# EAGLE design RevellerZero (EAGLE 7.6.0)
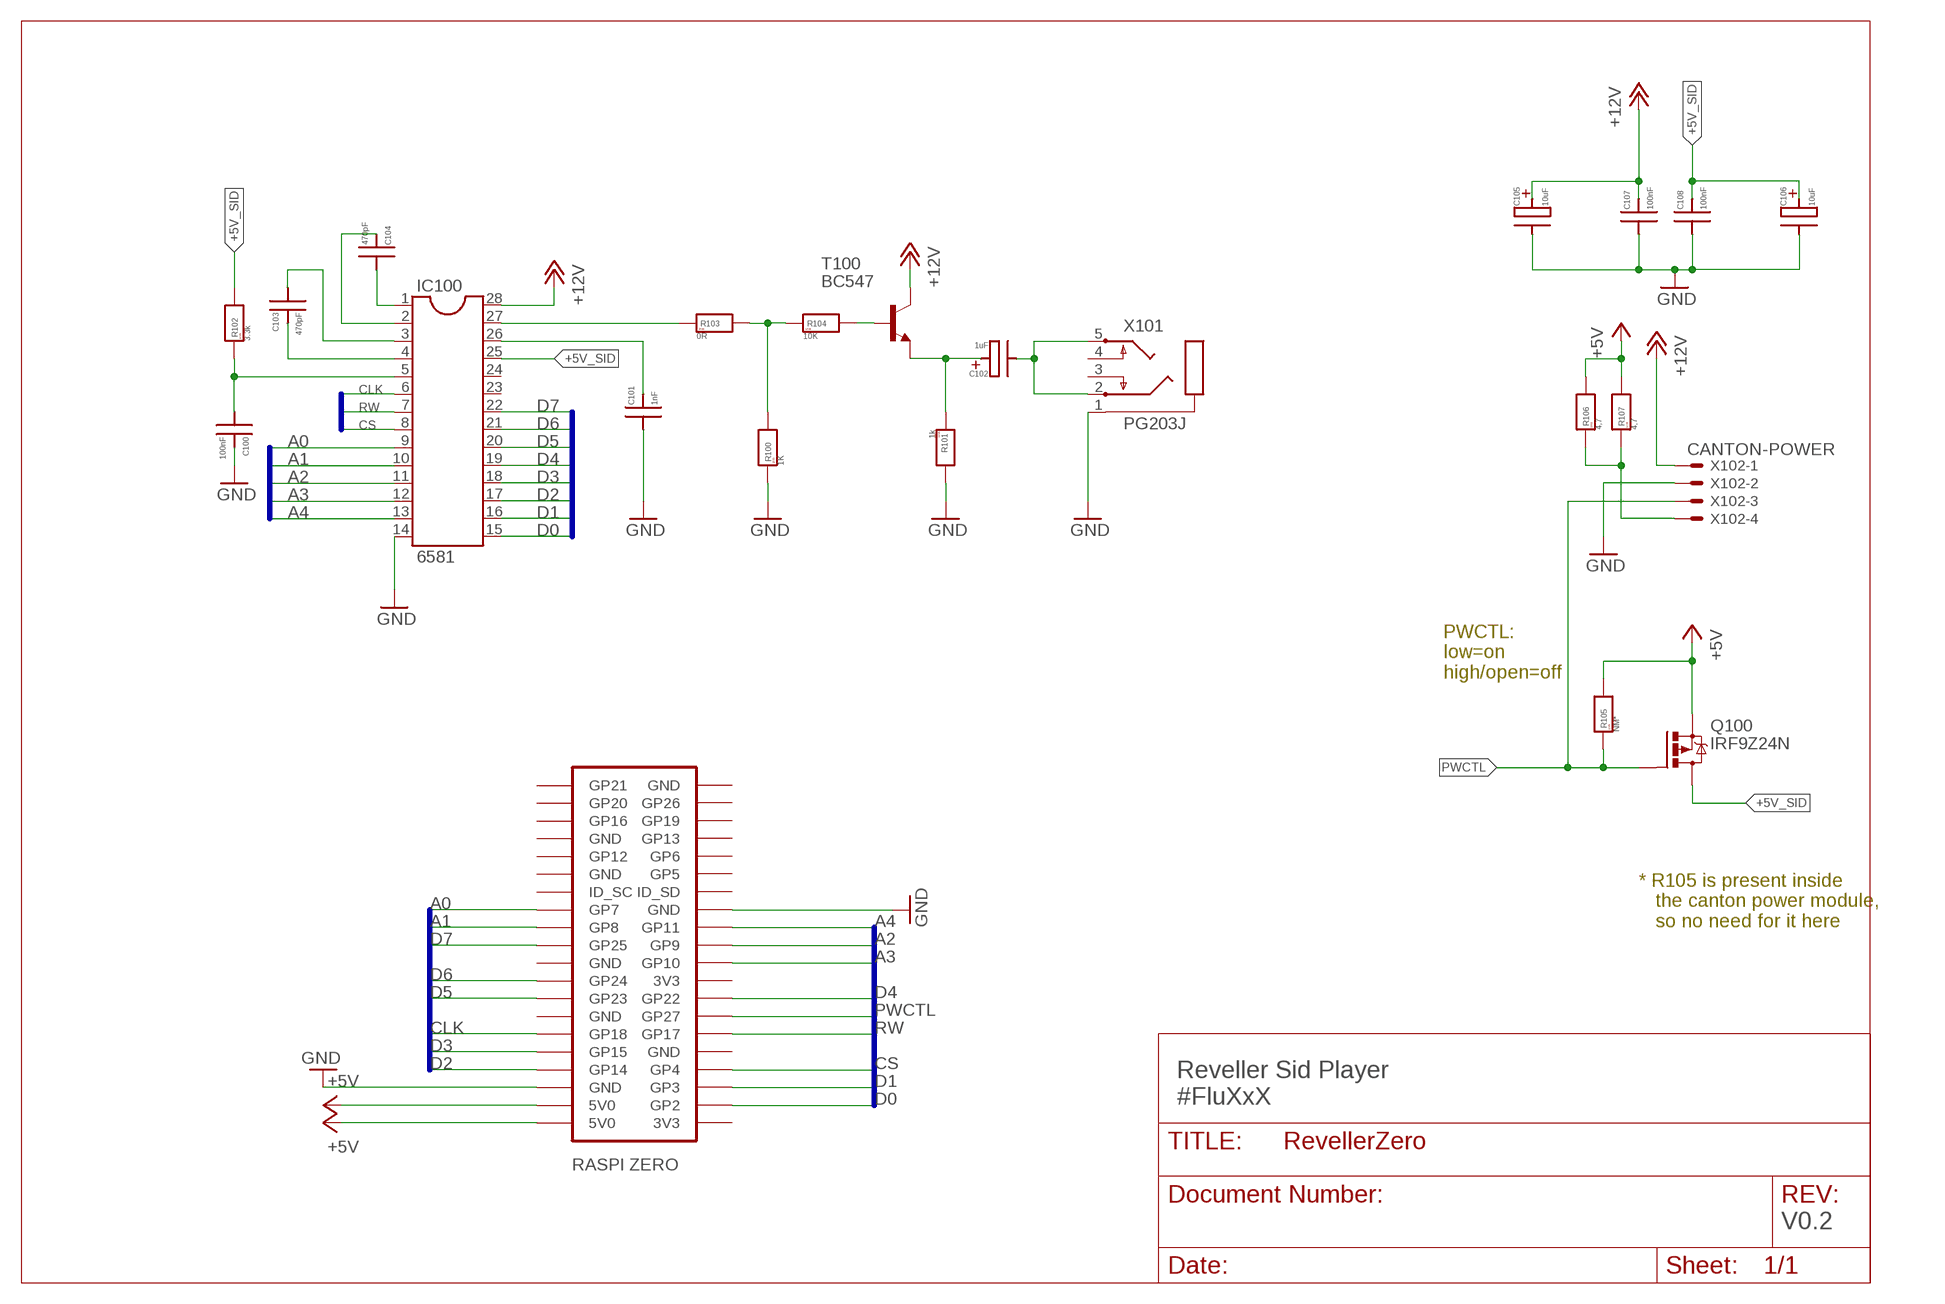
[diagram p0: schematic, sheet 1]

## Parts
C100  100nF  SMD-IPC_CAPC1206  [SMD-IPC_C1206]
C101  1nF  SMD-IPC_CAPC1206  [SMD-IPC_C1206]
C102  1uF  SMD-IPC_CAPPOLPXE_H  [PXE-H]
C103  470pF  SMD-IPC_CAPC1206  [SMD-IPC_C1206]
C104  470pF  SMD-IPC_CAPC1206  [SMD-IPC_C1206]
C105  10uF  SMD-IPC_CAPPOLC7343  [SMD-IPC_CT7343]
C106  10uF  SMD-IPC_CAPPOLC7343  [SMD-IPC_CT7343]
C107  100nF  SMD-IPC_CAPC1206  [SMD-IPC_C1206]
C108  100nF  SMD-IPC_CAPC1206  [SMD-IPC_C1206]
IC100  6581  DIL28  [DIL28-6]
Q100  IRF9Z24N  IRF9530  [TO220BV]
R100  1K  SMD-IPC_RESR1206  [SMD-IPC_R1206]
R101  1k  SMD-IPC_RESR1206  [SMD-IPC_R1206]
R102  3.3k  SMD-IPC_RESR1206  [SMD-IPC_R1206]
R103  0R  SMD-IPC_RESR1206  [SMD-IPC_R1206]
R104  10K  SMD-IPC_RESR1206  [SMD-IPC_R1206]
R105  NM*  SMD-IPC_RESR1206  [SMD-IPC_R1206]
R106  4,7  SMD-IPC_RESR1206  [SMD-IPC_R1206]
R107  4,7  SMD-IPC_RESR1206  [SMD-IPC_R1206]
T100  BC547  [TO92]
U$1  ZERO  [ZERO]
X101  PG203J  [PG203J]
X102  CANTON-POWER  22-23-2041  [22-23-2041]

## Nets
+5V: Q100.S R105.2 R106.2 R107.2 U$1.2(5V0) U$1.4(5V0)
+5V_SID: C106.+ C108.+ IC100.25 Q100.D R102.2
+5VEZ: R106.1 R107.1 X102.4
+12V: C105.+ C107.+ IC100.28 T100.3(C) X102.1
A0 [data]: IC100.9 U$1.26(GP7)
A1 [data]: IC100.10 U$1.24(GP8)
A2 [data]: IC100.11 U$1.21(GP9)
A3 [data]: IC100.12 U$1.19(GP10)
A4 [data]: IC100.13 U$1.23(GP11)
AUDIO_DC: C102.+ R101.1 T100.1(E)
AUDIO_OUT: C102.- X101.2 X101.5
AUDIO_PREAMP: R100.2 R103.2 R104.1
AUDIO_PREAMP_B: R104.2 T100.2(B)
AUDIO_RAW: IC100.27 R103.1
CAP1A: C104.- IC100.1
CAP1B: C104.+ IC100.2
CAP2A: C103.- IC100.3
CAP2B: C103.+ IC100.4
CAPX: C101.+ IC100.26
CLK [data]: IC100.6 U$1.12(GP18)
CS [data]: IC100.8 U$1.7(GP4)
D0 [data]: IC100.15 U$1.3(GP2)
D1 [data]: IC100.16 U$1.5(GP3)
D2 [data]: IC100.17 U$1.8(GP14)
D3 [data]: IC100.18 U$1.10(GP15)
D4 [data]: IC100.19 U$1.15(GP22)
D5 [data]: IC100.20 U$1.16(GP23)
D6 [data]: IC100.21 U$1.18(GP24)
D7 [data]: IC100.22 U$1.22(GP25)
GND: C100.+ C101.- C105.- C106.- C107.- C108.- IC100.14 R100.1 R101.2 U$1.6(GND) U$1.25(GND) X101.1 X102.2
PWCTL [data]: Q100.G R105.1 U$1.13(GP27) X102.3
RESET: C100.- IC100.5 R102.1
RW [data]: IC100.7 U$1.11(GP17)
Unconnected: IC100.23 IC100.24 U$1.1(3V3) U$1.9(GND) U$1.14(GND) U$1.17(3V3) U$1.20(GND) U$1.27(ID_SD) U$1.28(ID_SC) U$1.29(GP5) U$1.30(GND) U$1.31(GP6) U$1.32(GP12) U$1.33(GP13) U$1.34(GND) U$1.35(GP19) U$1.36(GP16) U$1.37(GP26) U$1.38(GP20) U$1.39(GND) U$1.40(GP21) X101.3 X101.4

## Buses
A[0..4]
A0,A1,D7,D6,D5,CLK,D3,D2
CLK,RW,CS
A4,A2,A3,D4,PWCTL,RW,CS,D1,D0
D[0..7]

## Notes on the sheet
- PWCTL:
  low=on
  high/open=off
- * R105 is present inside
     the canton power module,
     so no need for it here
- Reveller Sid Player
  #FluXxX
- V0.2

## Library data of the parts
C100 C101 C103 C104 C107 C108 = cyviz:SMD-IPC_CAP: Capacitor, non polarized
C102 C105 C106 = cyviz:SMD-IPC_CAPPOL: Polarized capacitor
IC100 = ic-package:DIL28: Dual In Line
Q100 = transistor-power:IRF9530: P-CHANNEL HEXFET POWER-MOS-FET Source: http://www.irf.com/product-info/datasheets/data/irf9530.pdf
R100-R107 = cyviz:SMD-IPC_RES: Resistor; SIZE: 1206
T100 = transistor:BC547: NPN TRANSISTOR
U$1 = RasPi:ZERO: Raspbery Pi Foundation Zero https://www.raspberrypi.org/products/pi-zero/
X101 = con-hirschmann:PG203J: MIC/HEADPHONE JACK KS-S stereo microphone/headphone jack PG203JN (Schukat); OC_FARNELL: unknown; OC_NEWARK: unknown
X102 = con-molex:22-23-2041: .100" (2.54mm) Center Header - 4 Pin; MF: MOLEX; MPN: 22-23-2041; OC_FARNELL: 1462920; OC_NEWARK: 38C0355

## Net classes
0 default: clearance 0.205 mm
1 data: width 0.3 mm, drill 0.5 mm

## Board
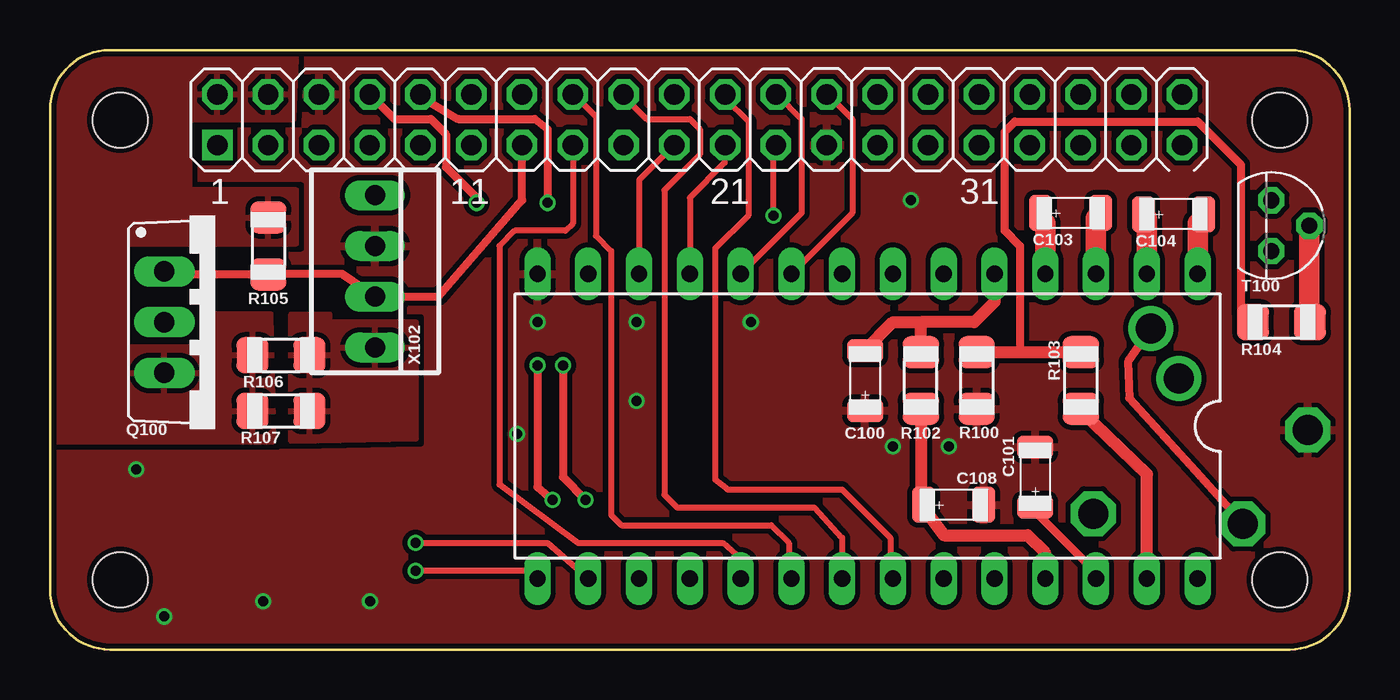
[diagram p1: board, top side]
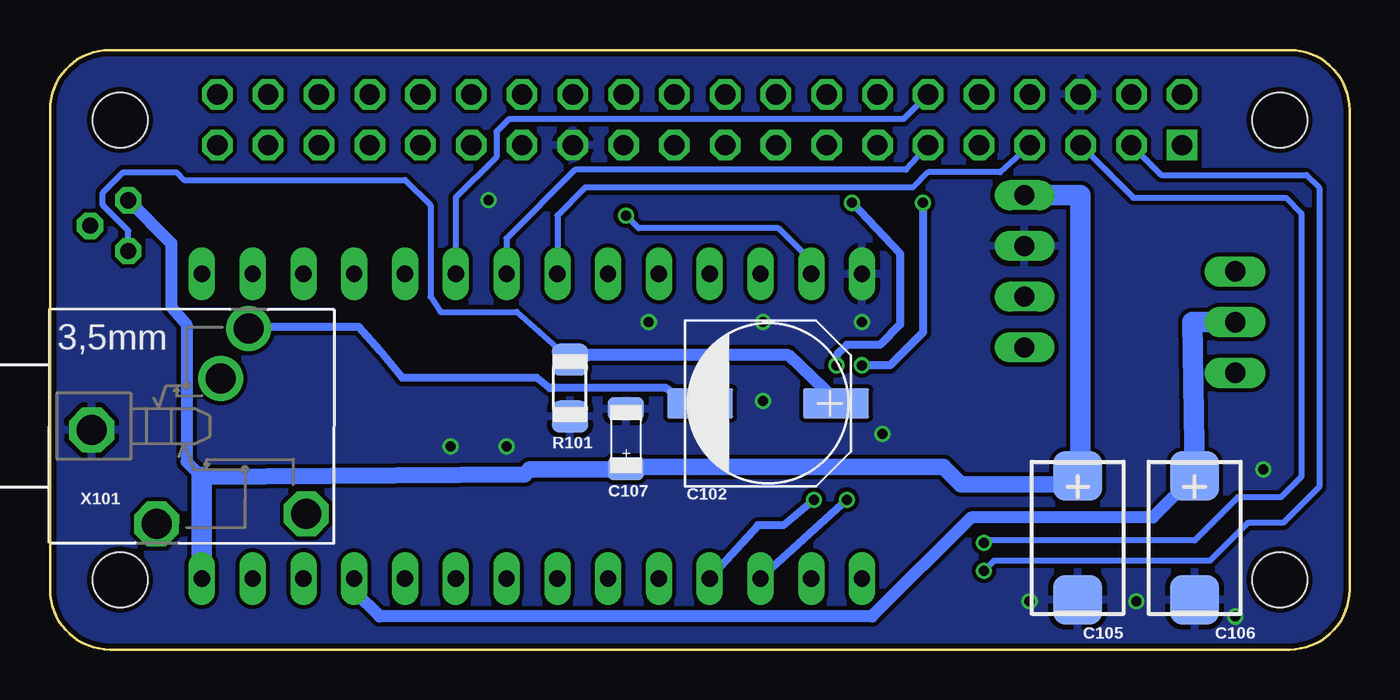
[diagram p2: board, bottom side, seen from below]

Size 65 x 30 mm. Coordinates in mm from the lower left corner, seen from the top.
Copper layers (1*16): Top 0.035mm / dielectric 1.5mm / Bottom 0.035mm
Design rules "SeeedStudio_2layer_DRU_no_angle_20140221": minimum track width 6mil, minimum drill 12mil, track to track 6mil, track to pad 6mil, pad to pad 6mil, via to via 6mil, smd to smd 0mil, copper to edge 10mil, drill to drill 10mil, minimum pad ring 10mil, minimum via ring 6mil, stop-mask expansion 2mil, vias tented up to drill 100mil, thermal gap 10mil

### Footprints (pad centres in the part's own frame; a part is rotated, then mirrored left to right if it is on the bottom)
SMD-IPC_C1206 = smd 1.15 x 1.8: + 1.5,0; - -1.5,0
PXE-H = smd 3.3 x 1.5: + 3.4,0; - -3.4,0
SMD-IPC_CT7343 = smd 2.45 x 2.45: + -3.1,0; - 3.1,0
DIL28-6 = drill 0.813 long: 1 -16.51,-7.62; 2 -13.97,-7.62; 3 -11.43,-7.62; 4 -8.89,-7.62; 5 -6.35,-7.62; 6 -3.81,-7.62; 7 -1.27,-7.62; 8 1.27,-7.62; 9 3.81,-7.62; 10 6.35,-7.62; 11 8.89,-7.62; 12 11.43,-7.62; 13 13.97,-7.62; 14 16.51,-7.62; 15 16.51,7.62; 16 13.97,7.62; 17 11.43,7.62; 18 8.89,7.62; 19 6.35,7.62; 20 3.81,7.62; 21 1.27,7.62; 22 -1.27,7.62; 23 -3.81,7.62; 24 -6.35,7.62; 25 -8.89,7.62; 26 -11.43,7.62; 27 -13.97,7.62; 28 -16.51,7.62
TO220BV = drill 1.016 long: D 0,-2.54; G -2.54,-2.54; S 2.54,-2.54
SMD-IPC_R1206 = smd 1.6 x 1.803: 1 -1.422,0; 2 1.422,0
TO92 = drill 0.813 octagon: 1 1.27,0; 2 0,1.905; 3 -1.27,0
ZERO = drill 1.016 square: 1 8.37,25.24 | drill 1.016 octagon: 2 8.37,27.78; 3 10.91,25.24; 4 10.91,27.78; 5 13.45,25.24; 6 13.45,27.78; 7 15.99,25.24; 8 15.99,27.78; 9 18.53,25.24; 10 18.53,27.78; 11 21.07,25.24; 12 21.07,27.78; 13 23.61,25.24; 14 23.61,27.78; 15 26.15,25.24; 16 26.15,27.78; 17 28.69,25.24; 18 28.69,27.78; 19 31.23,25.24; 20 31.23,27.78; 21 33.77,25.24; 22 33.77,27.78; 23 36.31,25.24; 24 36.31,27.78; 25 38.85,25.24; 26 38.85,27.78; 27 41.39,25.24; 28 41.39,27.78; 29 43.93,25.24; 30 43.93,27.78; 31 46.47,25.24; 32 46.47,27.78; 33 49.01,25.24; 34 49.01,27.78; 35 51.55,25.24; 36 51.55,27.78; 37 54.09,25.24; 38 54.09,27.78; 39 56.63,25.24; 40 56.63,27.78 | hole 2.75: 3.5,3.5; 3.5,26.5; 61.5,26.5; 61.5,3.5
PG203J = drill 1.499 octagon: 1 -5.004,-0.203; 4 5.74,-4.369; 5 -1.753,-4.902 | drill 1.499: 2 2.845,4.902; 3 1.448,2.388
22-23-2041 = drill 1 long: 1 -3.81,0; 2 -1.27,0; 3 1.27,0; 4 3.81,0

### Placement (x,y rotation side)
C100  40.77,13.46 270 top
C101  49.28,8.64 270 top
C102  29.08,12.32 0 bottom
C103  51.05,21.84 180 top
C104  56.2,21.78 180 top
C105  13.59,5.59 270 bottom
C106  7.75,5.59 270 bottom
C107  36.2,10.54 270 bottom
C108  45.21,7.24 180 top
IC100  40.89,11.18 180 top
Q100  8.26,16.38 270 top
R100  46.35,13.46 90 top
R101  38.99,13.08 270 bottom
R102  43.56,13.46 270 top
R103  51.56,13.46 90 top
R104  61.59,16.38 0 top
R105  10.92,20.19 90 top
R106  11.56,14.73 180 top
R107  11.56,11.94 180 top
T100  61.09,21.21 270 top
U$1  0,0 0 top
X101  57.91,11.18 359.9 bottom
X102  16.26,18.92 270 top

### Tracks (layer width: path | path; a pad name or v marks a point on that pad's centre or on a via)
+5V
  Top 1.016: R105.2 10.79,21.61
  pour Top (isolate 0.254, rank 2): 12.19,26.54 12.32,29.59 2.03,30.35 -0.38,27.94 0.13,10.41 11.18,10.41 11.05,16.76 7.87,16.76 7.87,15.11 3.81,15.11 3.81,20.32 12.32,20.32 12.32,22.99 6.99,22.99 6.99,26.54
+5V_SID
  Top 0.406: C108.+ 43.56,7.24
  Top 0.61: IC100.25 49.78,4.83 48.9,5.71 44.7,5.71 43.56,7.24 R102.2
  Top 1.016: 49.76,3.56 IC100.25
  Bottom 0.61: C106.+ 9.83,6.6 18.92,6.6 23.88,1.65 48.51,1.65 49.78,2.92 IC100.25
  Bottom 1.016: C106.+ 7.87,16.38 Q100.D
+5VEZ
  pour Top (rank 3): 12.06,10.41 12.06,16.76 13.97,16.76 13.97,16.38 18.29,16.38 18.29,10.54
+12V
  Bottom 0.61: T100.3 58.93,20.32 58.93,17.14 58.17,16.26 58.17,9.4 57.4,8.64
  Bottom 0.813: 57.4,8.64 41.27,8.76 41.02,9.02 36.96,9.02 C107.+ 35.33,9.14 20.32,9.14 19.43,8.26 14.02,8.26 C105.+
  Bottom 1.016: C105.+ 13.46,8.69 13.46,22.73 X102.1 | 57.4,8.64 IC100.28
A0
  Top 0.305: U$1.26 38.9,27.78 40.13,26.54 40.13,21.84 IC100.9
A1
  Top 0.305: U$1.24 36.35,27.78 37.59,26.54 37.59,21.84 IC100.10
A2
  Top 0.305: U$1.21 33.75,25.24 33.75,24.35 32,22.61 IC100.11
A3
  Top 0.305: U$1.19 31.21,25.24 29.46,23.5 IC100.12
A4  (via drill 0.5)
  Top 0.305: v36.2,21.72 36.2,25.12 U$1.23
  Bottom 0.305: IC100.13 26.92,19.43 28.57,21.08 35.56,21.08 v36.2,21.72
AUDIO_DC
  Bottom 0.305: T100.1 61.09,20.95 62.36,22.23 62.36,22.86 61.34,23.88 58.67,23.88 58.29,23.5 47.24,23.5 45.97,22.23 45.97,17.65 45.47,16.89 41.66,16.89 R101.1
  Bottom 0.61: C102.+ 25.68,12.47 28.07,14.73 38.08,14.73 R101.1
AUDIO_OUT
  Top 0.406: X101.2 53.92,14.41 53.98,12.57 57.53,8.67 X101.5
  Bottom 0.406: C102.- 33.15,12.32 34.16,13.08 40.01,13.08 40.64,13.59 47.37,13.59 48.51,14.99 49.53,16.13 54.62,16.13 X101.2
AUDIO_PREAMP
  Top 0.406: R104.1 59.56,16.87 59.56,24.26 57.4,26.42 48.26,26.42 47.75,25.91 47.75,20.95 48.51,20.19 48.51,14.88
  Top 0.61: R100.2 48.51,14.88 R103.2
AUDIO_PREAMP_B
  Top 0.61: R104.2 62.99,16.38
  Top 1.016: 62.99,16.38 T100.2
AUDIO_RAW
  Top 0.61: IC100.27 54.86,8.76 51.56,11.94 R103.1
  Top 1.016: IC100.27 54.89,3.56
CAP1A
  Top 1.016: IC100.1 57.4,21.34 57.57,21.34 C104.-
CAP1B
  Top 1.016: IC100.2 54.86,21.59 C104.+
CAP2A
  Top 1.016: IC100.3 52.32,21.59 C103.-
CAP2B
  Top 1.016: IC100.4 49.78,21.34 49.55,21.34 C103.+
CAPX
  Top 0.406: 52.3,3.56 52.3,3.86 49.28,6.88 C101.+
  Top 1.016: IC100.26 52.3,3.56
CLK
  Bottom 0.305: U$1.12 22.31,26.54 42.04,26.54 42.67,25.91 42.67,24.64 44.7,22.61 IC100.6
CS
  Bottom 0.305: U$1.7 17.48,23.88 21.08,23.88 21.84,23.11 38.23,23.11 39.62,21.72 IC100.8
D0  (via drill 0.5)
  Top 0.305: IC100.15 23.88,3.94 v18.29,3.94
  Bottom 0.305: U$1.3 9.42,23.75 2.16,23.75 1.52,23.11 1.52,8.13 3.3,6.35 5.08,6.35 6.99,4.45 17.78,4.45 v18.29,3.94
D1  (via drill 0.5)
  Top 0.305: v18.29,5.33 24.89,5.33 IC100.16
  Bottom 0.305: U$1.5 10.82,22.61 3.17,22.61 2.41,21.84 2.41,8.64 3.43,7.62 5.59,7.62 7.75,5.46 18.16,5.46 v18.29,5.33
D2  (via drill 0.5)
  Top 0.406: v24.38,14.22 24.38,8.13 v25.15,7.49 | U$1.8 17.23,26.54 19.05,26.54 19.81,25.78 19.81,24.13 21.34,22.61 v21.34,22.35
  Bottom 0.406: v24.38,14.22 22.99,14.22 21.34,15.88 v21.34,22.35 | v25.15,7.49 IC100.17
D3  (via drill 0.5)
  Top 0.305: 18.53,27.67 U$1.10
  Top 0.406: v25.65,14.22 25.65,8.64 v26.8,7.49 | 18.53,27.67 20.42,26.54 24.26,26.54 24.89,26.04 v24.89,22.35
  Bottom 0.406: v25.65,14.22 25.65,14.73 25.15,15.24 23.5,15.24 22.48,16.26 22.48,19.81 v24.89,22.35 | v26.8,7.49 28.32,6.22 29.59,6.22 IC100.18
D4
  Top 0.305: U$1.15 26.15,21.32 25.78,20.95 23.24,20.95 22.48,20.19 22.48,8.26 26.42,5.33 33.66,5.33 34.54,4.57 IC100.19
D5
  Top 0.305: U$1.16 26.2,27.78 27.3,26.67 27.3,20.7 28.07,19.94 28.07,6.73 28.57,6.22 36.07,6.22 36.96,5.33 36.96,3.68 IC100.20
D6
  Top 0.305: U$1.18 28.69,27.7 29.84,26.54 32,26.54 32.51,26.04 32.51,24.77 30.73,22.99 30.73,7.75 31.37,7.11 38.23,7.11 39.62,5.59 IC100.21
D7
  Top 0.305: U$1.22 33.77,27.57 34.92,26.42 34.92,21.72 33.27,20.07 33.27,8.51 33.91,8 39.62,8 42.04,5.59 42.04,3.68 IC100.22
GND  (via drill 0.5)
  other vias: 16,2.41 42.16,10.16 44.96,10.16 29.34,16.38 43.05,22.48 35.05,16.38 29.34,12.45 24.38,16.38 23.37,10.79 10.67,2.41 5.71,1.65 4.32,9.02
  pour Bottom: 62.1,29.84 3.05,29.84 arc90 0.13,27.05 0.13,3.17 arc90 3.05,0.13 61.85,0.13 arc90 64.9,3.17 64.9,27.05 arc90
  pour Bottom (isolate 0.254): 62.1,29.84 2.92,29.84 arc90 0.25,26.54 0.13,3.17 arc90 3.05,0.13 61.85,0.13 arc90 64.9,3.17 64.9,27.05 arc90
  pour Top (isolate 0.254, rank 6): 62.1,29.84 3.05,29.84 arc90 0.13,27.05 0.13,3.17 arc90 3.05,0.13 61.85,0.13 arc90 64.9,3.17 64.9,27.05 arc90
PWCTL
  Top 0.406: 5.84,18.77 R105.1 10.95,18.8 14.61,18.8 X102.3 19.43,17.65 23.62,22.48 23.62,25.23 U$1.13
  Top 1.016: 5.84,18.77 Q100.G
RESET
  Top 0.61: IC100.5 47.24,17.4 46.23,16.38 43.56,16.38 | R102.1 43.56,16.38 | C100.- 42.16,16.38 43.56,16.38
RW
  Bottom 0.305: U$1.11 22.18,24 38.73,24 42.16,20.57 IC100.7

### Text on the board
tStop: Reveller-Zero / Sidplayer / #FluxXx
tCream: Reveller-Zero / Sidplayer / #FluxXx